# Altium schematic sheet USB.SchDoc: USB
size A4; Author: -; CompanyName: IOElectro; DrawnBy: Esmaeill M; Engineer: -; Organization: IOElectro; Address1: Bushehr,Iran; Address2: www.ioelectro.ir; DocumentNumber: 3; Revision: v0.1; SheetNumber: 3; SheetTotal: 6; ProjectNumber: 1013; Note: USB
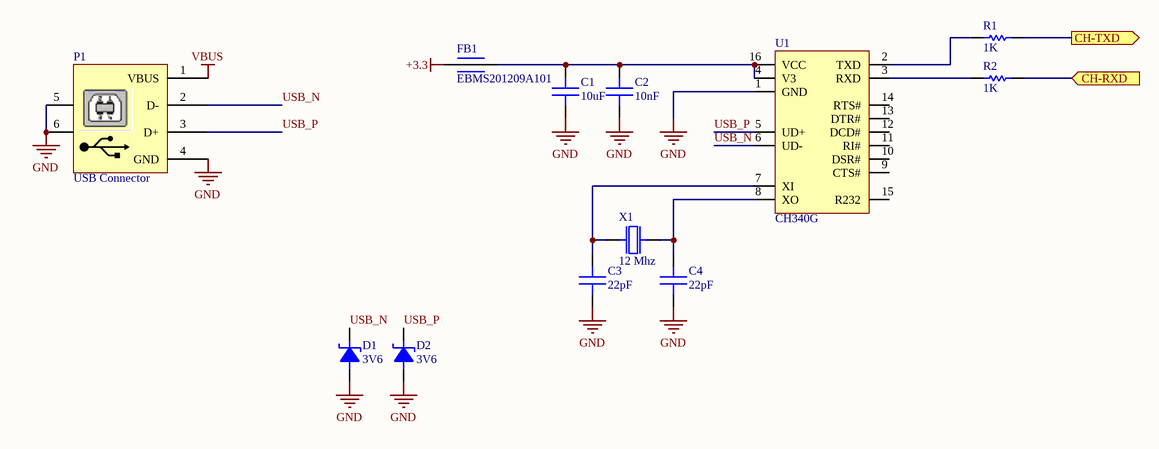
[diagram p0: USB.SchDoc]

## Parts
C1  10uF  [C-0805]
C2  10nF  [C-0805]
C3  22pF  [C-0805]
C4  22pF  [C-0805]
D1  3V6  [SOD80]
D2  3V6  [SOD80]
FB1  EBMS201209A101  [L-0805]
P1  USB Connector  [USB2.5-2H4E]
R1  1K  [R-0805]
R2  1K  [R-0805]
U1  CH340G  [SOP-16]
X1  12 Mhz  [XTAL-DIP_Small]

## Ports
CH-RXD (in), CH-TXD (out)

## Nets
+3.3: FB1.1
GND: C1.2 C2.2 C3.2 C4.2 D1.A D2.A P1.4(GND) P1.5 P1.6 U1.1(GND)
VBUS: P1.1(VBUS)
CH-RXD: R2.2 ; port CH-RXD
CH-TXD: R1.2 ; port CH-TXD
USB_N: D1.K P1.2(D-) U1.6(UD-)
USB_P: D2.K P1.3(D+) U1.5(UD+)
NetC1_1: C1.1 C2.1 FB1.2 U1.4(V3) U1.16(VCC)
NetC3_1: C3.1 U1.7(XI) X1.2
NetC4_1: C4.1 U1.8(XO) X1.1
NetR1_1: R1.1 U1.2(TXD)
NetR2_1: R2.1 U1.3(RXD)

Not connected (* = marked no-connect by the designer): U1 9(CTS#) 10(DSR#) 11(RI#) 12(DCD#) 13(DTR#) 14(RTS#) 15(R232)

## Notes on the sheet
- Title
- Size:
- Date:
- A4
- Project Number:
- Time:
- Revision:
- Sheet
- of
- Drawn By:
- IOElectro
- File:
- Note:

## Library data of the parts
C1-C4 = CAP: SMD 0805
D1 D2 = DIODE-Z: SMD MiniMELF
FB1 = EBMS201209A101: FERRITE BEAD 0805 100R 100Mhz
P1 = USB-B: USB Connector-B Type; Designer: Eng. Saeid Jorablo; Company: DASE Co; Adding Date: 10/26/2010
R1 R2 = RES: 0805
U1 = CH340G: IC USB to Serial; Case/Package: MSOP-10
X1 = XTAL: Crystal oscillator